# Altium schematic sheet Hello.SchDoc
size A4
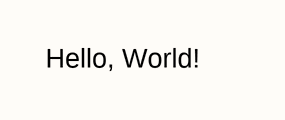
[diagram p0: Hello.SchDoc]

## Notes on the sheet
- Hello, World!